# EAGLE design conc contro0l (EAGLE 9.6.2)
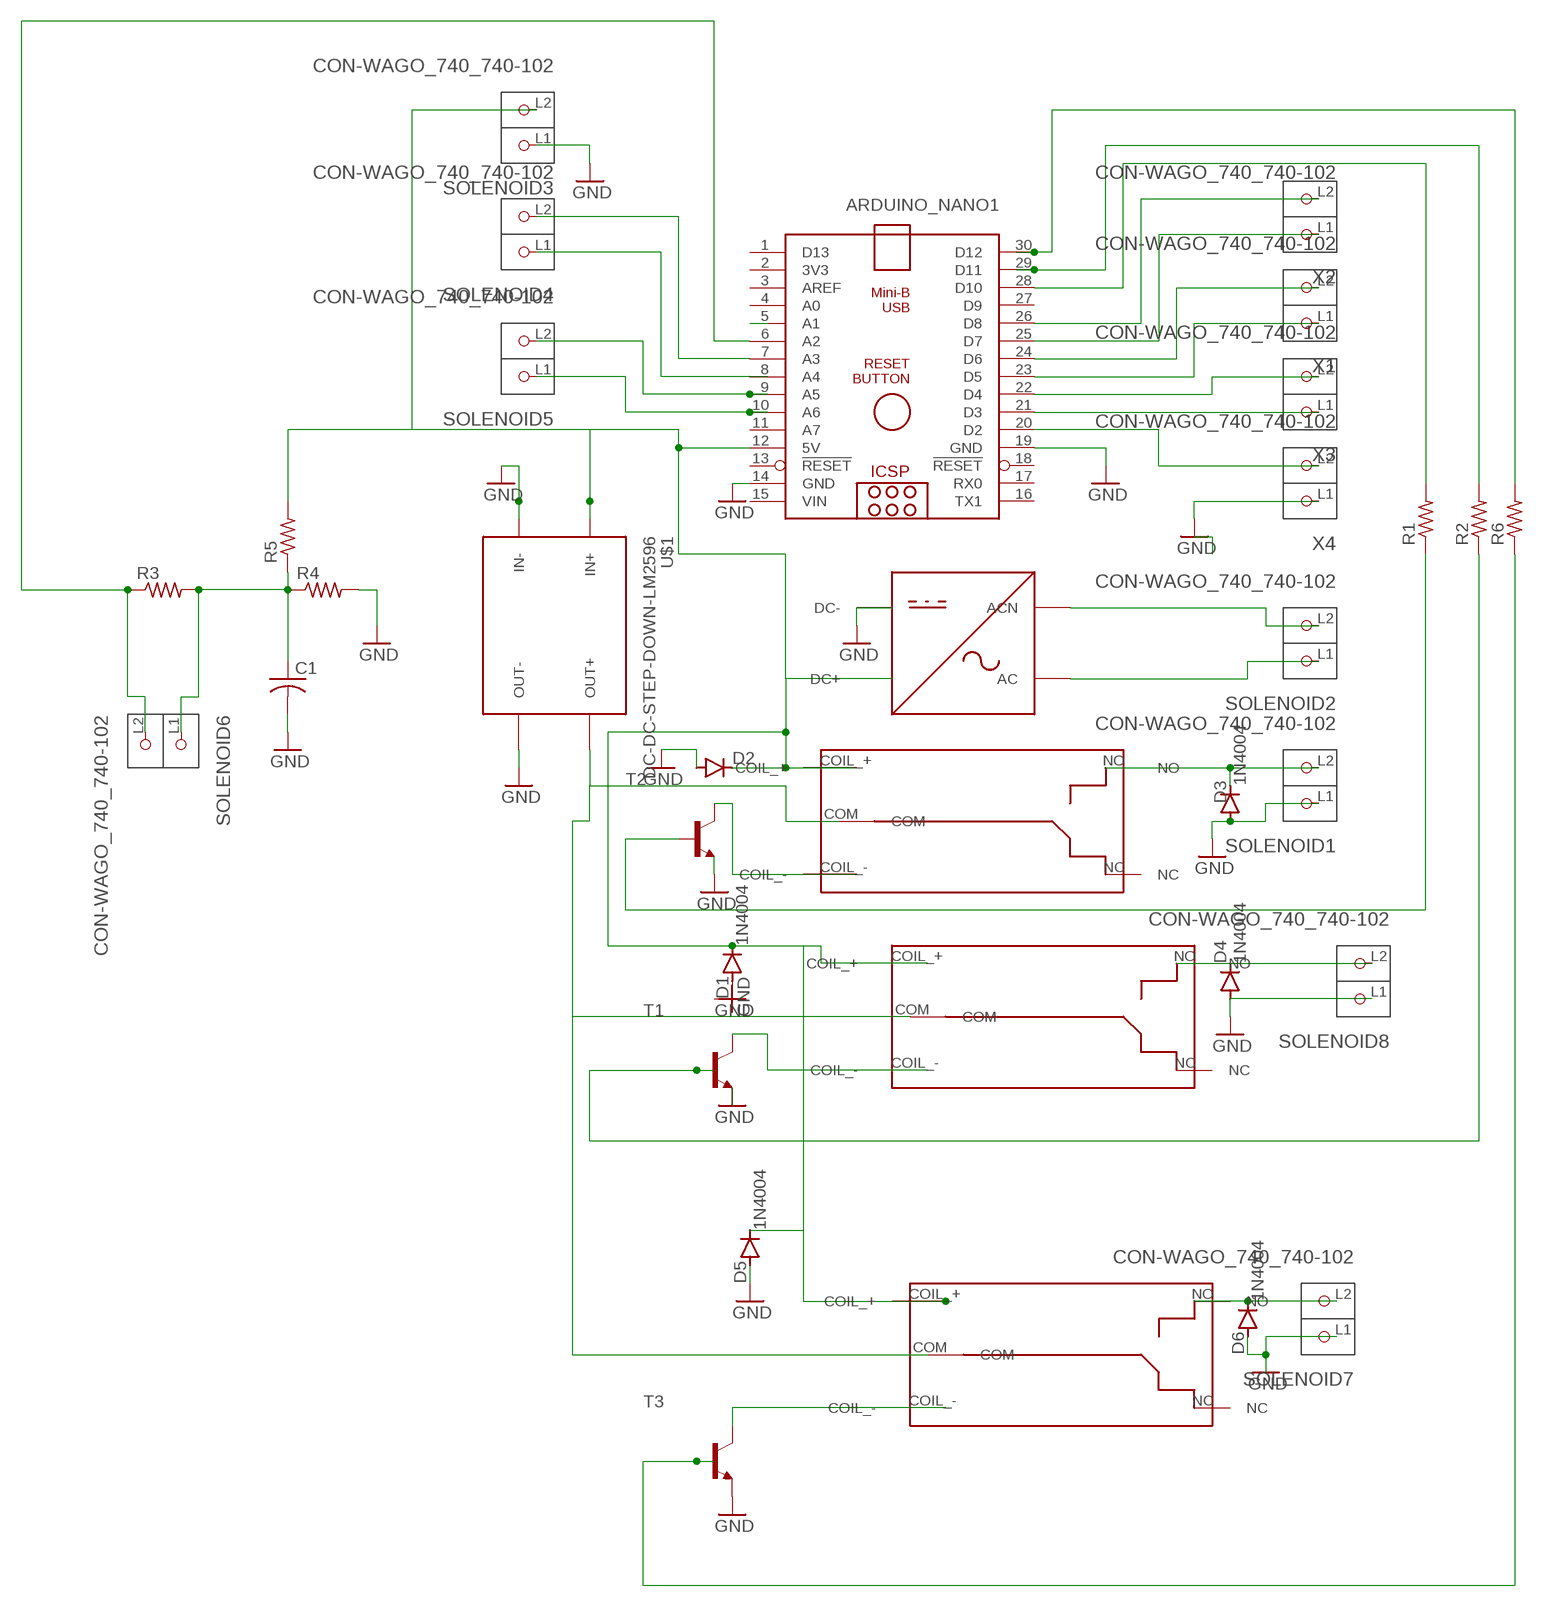
[diagram p0: schematic, sheet 1]

## Parts
ACDC  RPD10W1S  [2343]
ARDUINO_NANO1  ARDUINONANOV30-GHIT_ARDUINO_NANO  [ARDUINONANOV30-GHIT_ARDUINO_NANO]
C1  C-US025-024X044  [C025-024X044]
D1  1N4004  [DO41-10]
D2  1N4004  [DO41-10]
D3  1N4004  [DO41-10]
D4  1N4004  [DO41-10]
D5  1N4004  [DO41-10]
D6  1N4004  [DO41-10]
R1  R-US_0411/15  [0411/15]
R2  R-US_0411/15  [0411/15]
R3  R-US_0309/10  [0309/10]
R4  R-US_0309/10  [0309/10]
R5  R-US_0309/10  [0309/10]
R6  R-US_0411/15  [0411/15]
SOLENOID1  CON-WAGO_740_740-102  [CON-WAGO_740_P-740-102]
SOLENOID2  CON-WAGO_740_740-102  [CON-WAGO_740_P-740-102]
SOLENOID3  CON-WAGO_740_740-102  [CON-WAGO_740_P-740-102]
SOLENOID4  CON-WAGO_740_740-102  [CON-WAGO_740_P-740-102]
SOLENOID5  CON-WAGO_740_740-102  [CON-WAGO_740_P-740-102]
SOLENOID6  CON-WAGO_740_740-102  [CON-WAGO_740_P-740-102]
SOLENOID7  CON-WAGO_740_740-102  [CON-WAGO_740_P-740-102]
SOLENOID8  CON-WAGO_740_740-102  [CON-WAGO_740_P-740-102]
T1  2N2222-NPN-TO92-EBC  [TO92-EBC]
T2  2N2222-NPN-TO92-EBC  [TO92-EBC]
T3  2N2222-NPN-TO92-EBC  [TO92-EBC]
U$1  DC-DC-STEP-DOWN-LM2596  [DC-DC-STEP-DOWN-LM2596]
U$2  RELAY_JQC-3F(T73)A  [JQC-3F(T73)]
U$3  RELAY_JQC-3F(T73)A  [JQC-3F(T73)]
U$4  RELAY_JQC-3F(T73)A  [JQC-3F(T73)]
X1  CON-WAGO_740_740-102  [CON-WAGO_740_P-740-102]
X2  CON-WAGO_740_740-102  [CON-WAGO_740_P-740-102]
X3  CON-WAGO_740_740-102  [CON-WAGO_740_P-740-102]
X4  CON-WAGO_740_740-102  [CON-WAGO_740_P-740-102]

## Nets
GND [power]: ACDC.DC- ARDUINO_NANO1.14(GND) ARDUINO_NANO1.19(GND) C1.2 D1.A D2.A D3.A D4.A D5.A D6.A R4.2 SOLENOID1.L1(P1) SOLENOID3.L1(P1) SOLENOID7.L1(P1) SOLENOID8.L1(P1) T1.E T2.E T3.E U$1.IN- U$1.OUT- X4.L1(P1)
N$1 [power]: ARDUINO_NANO1.7(A3) SOLENOID4.L2(P2)
N$2 [power]: ARDUINO_NANO1.20(D2) X4.L2(P2)
N$3 [power]: ARDUINO_NANO1.21(D3) X3.L1(P1)
N$4 [power]: ARDUINO_NANO1.22(D4) X3.L2(P2)
N$5 [power]: ARDUINO_NANO1.23(D5) X1.L1(P1)
N$6 [power]: ARDUINO_NANO1.24(D6) X1.L2(P2)
N$7: ARDUINO_NANO1.28(D10) R1.2
N$8 [power]: ARDUINO_NANO1.26(D8) X2.L2(P2)
N$9 [power]: ARDUINO_NANO1.9(A5) SOLENOID5.L2(P2)
N$10 [power]: ACDC.DC+ ARDUINO_NANO1.12(5V) D1.C D2.C D5.C R5.2 SOLENOID3.L2(P2) U$1.IN+ U$2.COIL_+ U$3.COIL_+ U$4.COIL_+
N$11 [power]: ACDC.ACN SOLENOID2.L2(P2)
N$12 [power]: ARDUINO_NANO1.10(A6) SOLENOID5.L1(P1)
N$13 [power]: D3.C SOLENOID1.L2(P2) U$2.NO
N$14 [power]: D4.C SOLENOID8.L2(P2) U$3.NO
N$15 [power]: T2.C U$2.COIL_-
N$16 [power]: R2.1 T1.B
N$17 [power]: ARDUINO_NANO1.25(D7) X2.L1(P1)
N$18 [power]: ACDC.AC SOLENOID2.L1(P1)
N$19 [power]: C1.1 R3.2 R4.1 R5.1 SOLENOID6.L1(P1)
N$20 [power]: R1.1 T2.B
N$22 [power]: T1.C U$3.COIL_-
N$23 [power]: ARDUINO_NANO1.5(A1)
N$24 [power]: ARDUINO_NANO1.8(A4) SOLENOID4.L1(P1)
N$25: R6.1 T3.B
N$26 [power]: ARDUINO_NANO1.6(A2) R3.1 SOLENOID6.L2(P2)
N$27: U$1.OUT+ U$2.COM U$3.COM U$4.COM
N$28 [power]: ARDUINO_NANO1.29(D11) R2.2
N$29 [power]: ARDUINO_NANO1.30(D12) R6.2
N$30: T3.C U$4.COIL_-
N$31: D6.C SOLENOID7.L2(P2) U$4.NO
Unconnected: ARDUINO_NANO1.1(D13) ARDUINO_NANO1.2(3V3) ARDUINO_NANO1.3(AREF) ARDUINO_NANO1.4(A0) ARDUINO_NANO1.11(A7) ARDUINO_NANO1.13(!RESET) ARDUINO_NANO1.16(TX1) ARDUINO_NANO1.17(RX0) ARDUINO_NANO1.18(!RESET) ARDUINO_NANO1.27(D9) U$2.NC U$3.NC U$4.NC

## Power pins joined to a net without a drawn wire
VIN: ARDUINO_NANO1.15(VIN)

## Library data of the parts
ACDC = My_libray:RPD10W1S
ARDUINO_NANO1 = Arduino Nano GHII:ARDUINONANOV30-GHIT_ARDUINO_NANO: Arduino Nano V3.0 Overview: The Arduino Nano is a small, complete, and breadboard-friendly board based on the ATmega328 (Arduino Nano 3.x) or ATmega168 (Arduino Nano 2.x). It has more or less the same functionality of the Arduino Duemilanove, but in a different package. It lacks only a DC power jack, and works with a Mini-B USB cable instead of a standard one. The Nano was designed and is being produced by Gravitech. Specifications: Microcontroller Atmel ATmega168 or ATmega328 Operating Voltage (logic level) 5 V Input Voltage (recommended) 7-12 V Input Voltage (limits) 6-20 V Digital I/O Pins 14 (of which 6 provide PWM output) Analog Input Pins 8 DC Current per I/O Pin 40 mA Flash Memory 16 KB (ATmega168) or 32 KB (ATmega328) of which 2 KB used by bootloader SRAM 1 KB (ATmega168) or 2 KB (ATmega328) EEPROM 512 bytes (ATmega168) or 1 KB (ATmega328) Clock Speed 16 MHz Dimensions 0.73" x 1.70" Length 45 mm Width 18 mm Weigth 5 g Power: The Arduino Nano can be powered via the Mini-B USB connection, 6-20V unregulated external power supply (pin 30), or 5V regulated external power supply (pin 27). The power source is automatically selected to the highest voltage source. Memory: The ATmega168 has 16 KB of flash memory for storing code (of which 2 KB is used for the bootloader); the ATmega328 has 32 KB, (also with 2 KB used for the bootloader). The ATmega168 has 1 KB of SRAM and 512 bytes of EEPROM (which can be read and written with the EEPROM library); the ATmega328 has 2 KB of SRAM and 1 KB of EEPROM. Input and Output: Each of the 14 digital pins on the Nano can be used as an input or output, using pinMode(), digitalWrite(), and digitalRead() functions. They operate at 5 volts. Each pin can provide or receive a maximum of 40 mA and has an internal pull-up resistor (disconnected by default) of 20-50 kOhms. In addition, some pins have specialized functions. Visit Arduino - ArduinoBoardNano <https://www.arduino.cc/en/Main/ArduinoBoardNano>
C1 = adafruit:C-US: CAPACITOR, American symbol
D1-D6 = diode:1N4004: DIODE general purpose rectifier, 1 A
R1-R6 = adafruit:R-US_: RESISTOR, American symbol
SOLENOID1-SOLENOID8 X1-X4 = Termnal block:CON-WAGO_740_740-102: Serie 740, Klemmenleiste für Leiterplatten 1 Lötstift/Pol / Series 740, PCB terminal strip 1 solder pin/pole Polzahl / Pole No.: 2 Rastermaß / Pitch: 5 mm Bemessungsspannung / Rated Voltage: 320 V Nennstrom / Nominal Current: 16 A Leiterquerschnitt / Conductor Size: 0.08 - 2.5 mm² Anschlusstechnik / Connection Technology: CAGE CLAMP® Lötstiftlänge: / Solder Pin Length: 5.1 mm Leitereinführung (zur Platine) / Conductor entry angle (to PCB): 0 ° Farbe / Color: grau / gray Stand: 01.01.2012. Die jeweils aktuellen Daten zu diesem Artikel finden Sie in unserem Produktkatalog, den Sie unter www.wago.com einsehen können. As of: 01/01/2012. Please find the newest data for this article in our product catalogue, which can be viewed under www.wago.com.
T1-T3 = transistor-neu-to92:*-NPN-: NPN Transistror
U$1 = GHIdiy-modules:DC-DC-STEP-DOWN-LM2596: DC/DC Step-Down Regulator based on LM2596-ADJ chip LM2596 datasheet available here: http://www.ti.com/lit/ds/symlink/lm2596.pdf Click here to find device on ebay.com <http://www.ebay.com/sch/lm2596+power+regulator>
U$2-U$4 = GHII Relay JQC:RELAY_JQC-3F(T73)

## Net classes
1 power: width 1.27 mm, drill 0.864 mm, clearance 0.762 mm

## Board
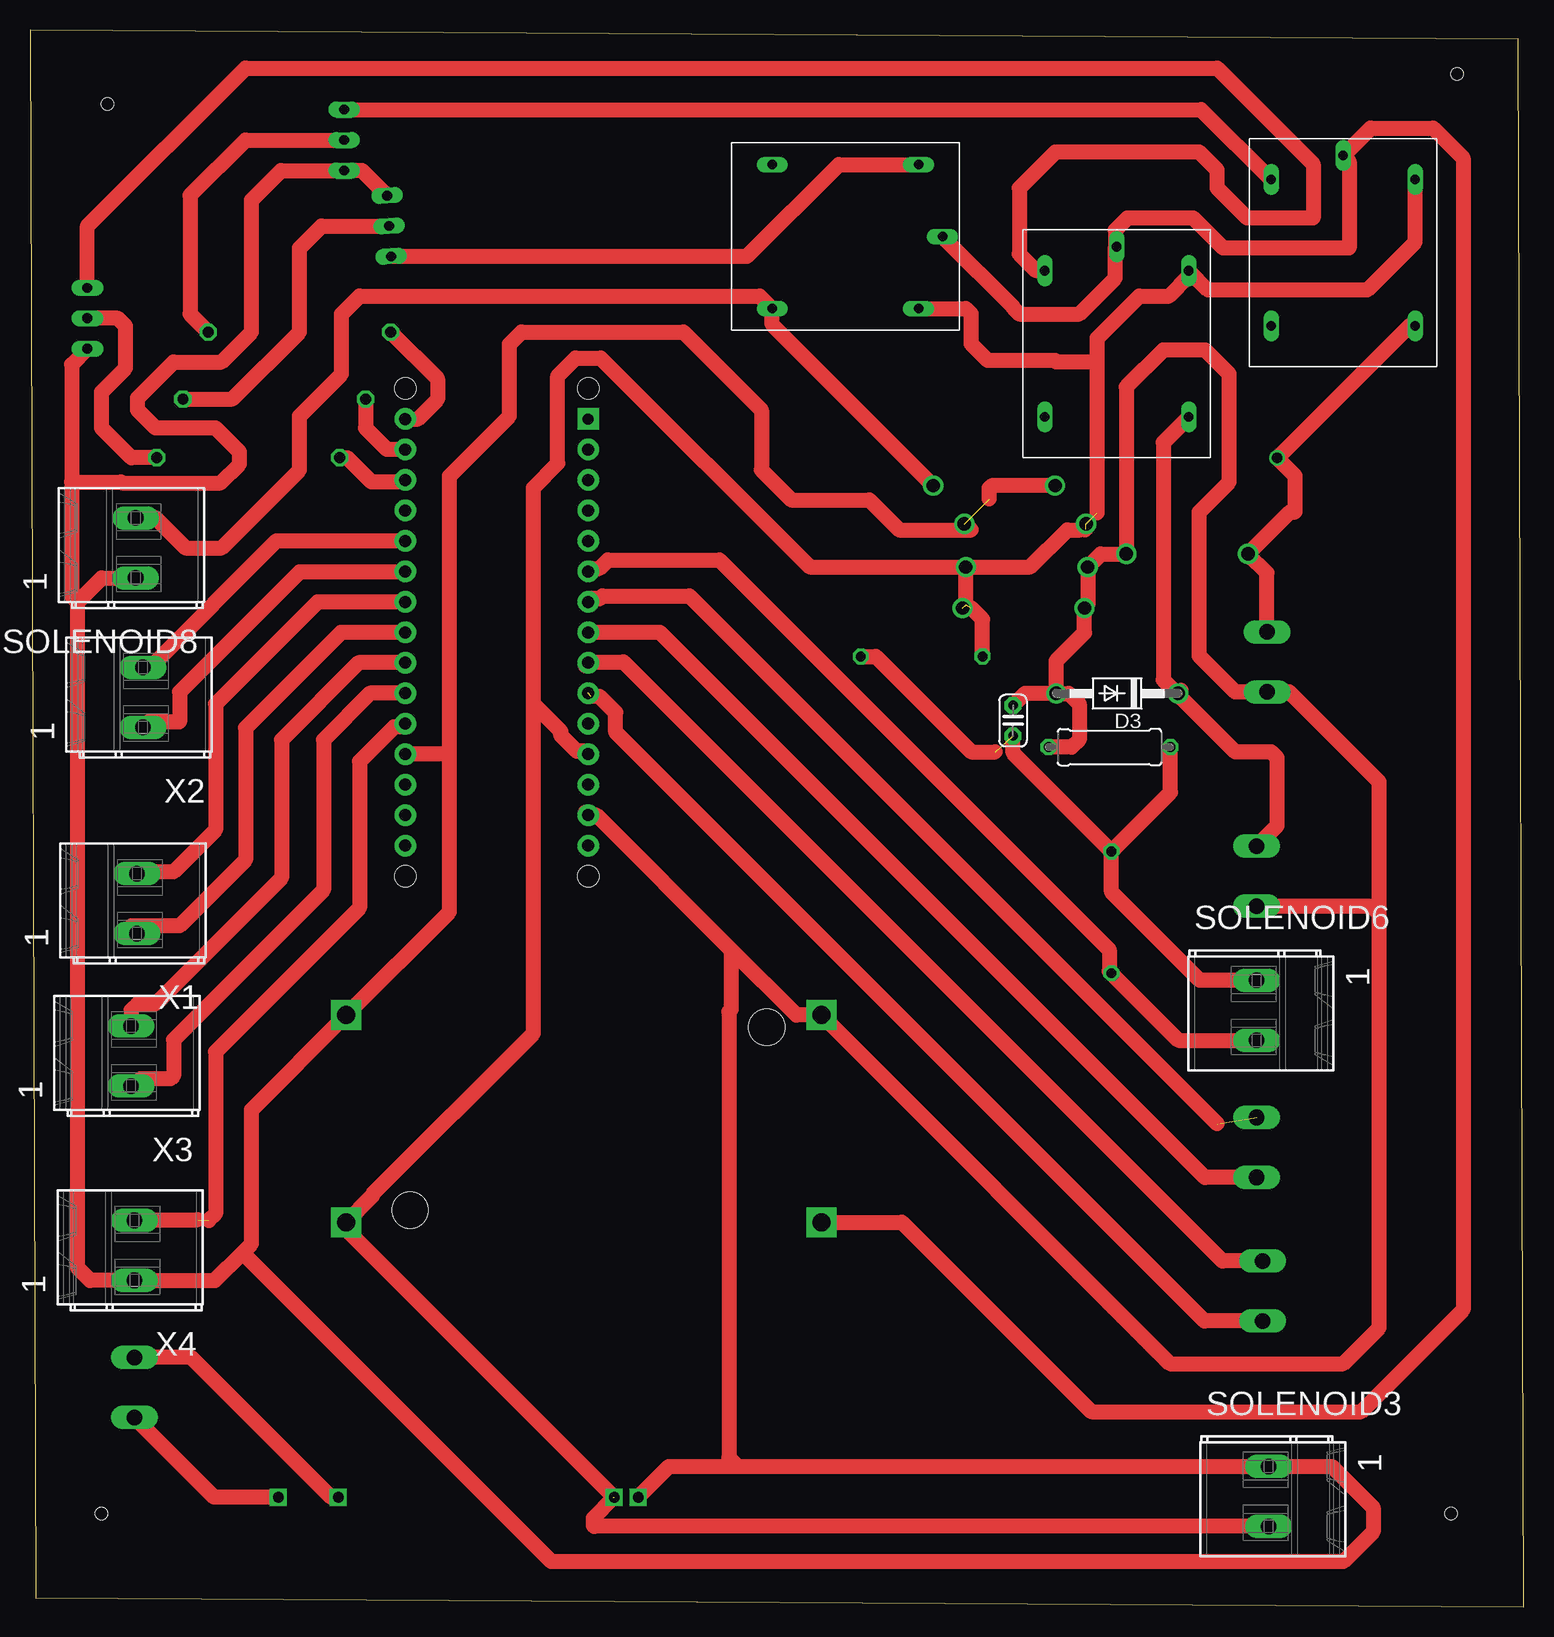
[diagram p1: board, top side]
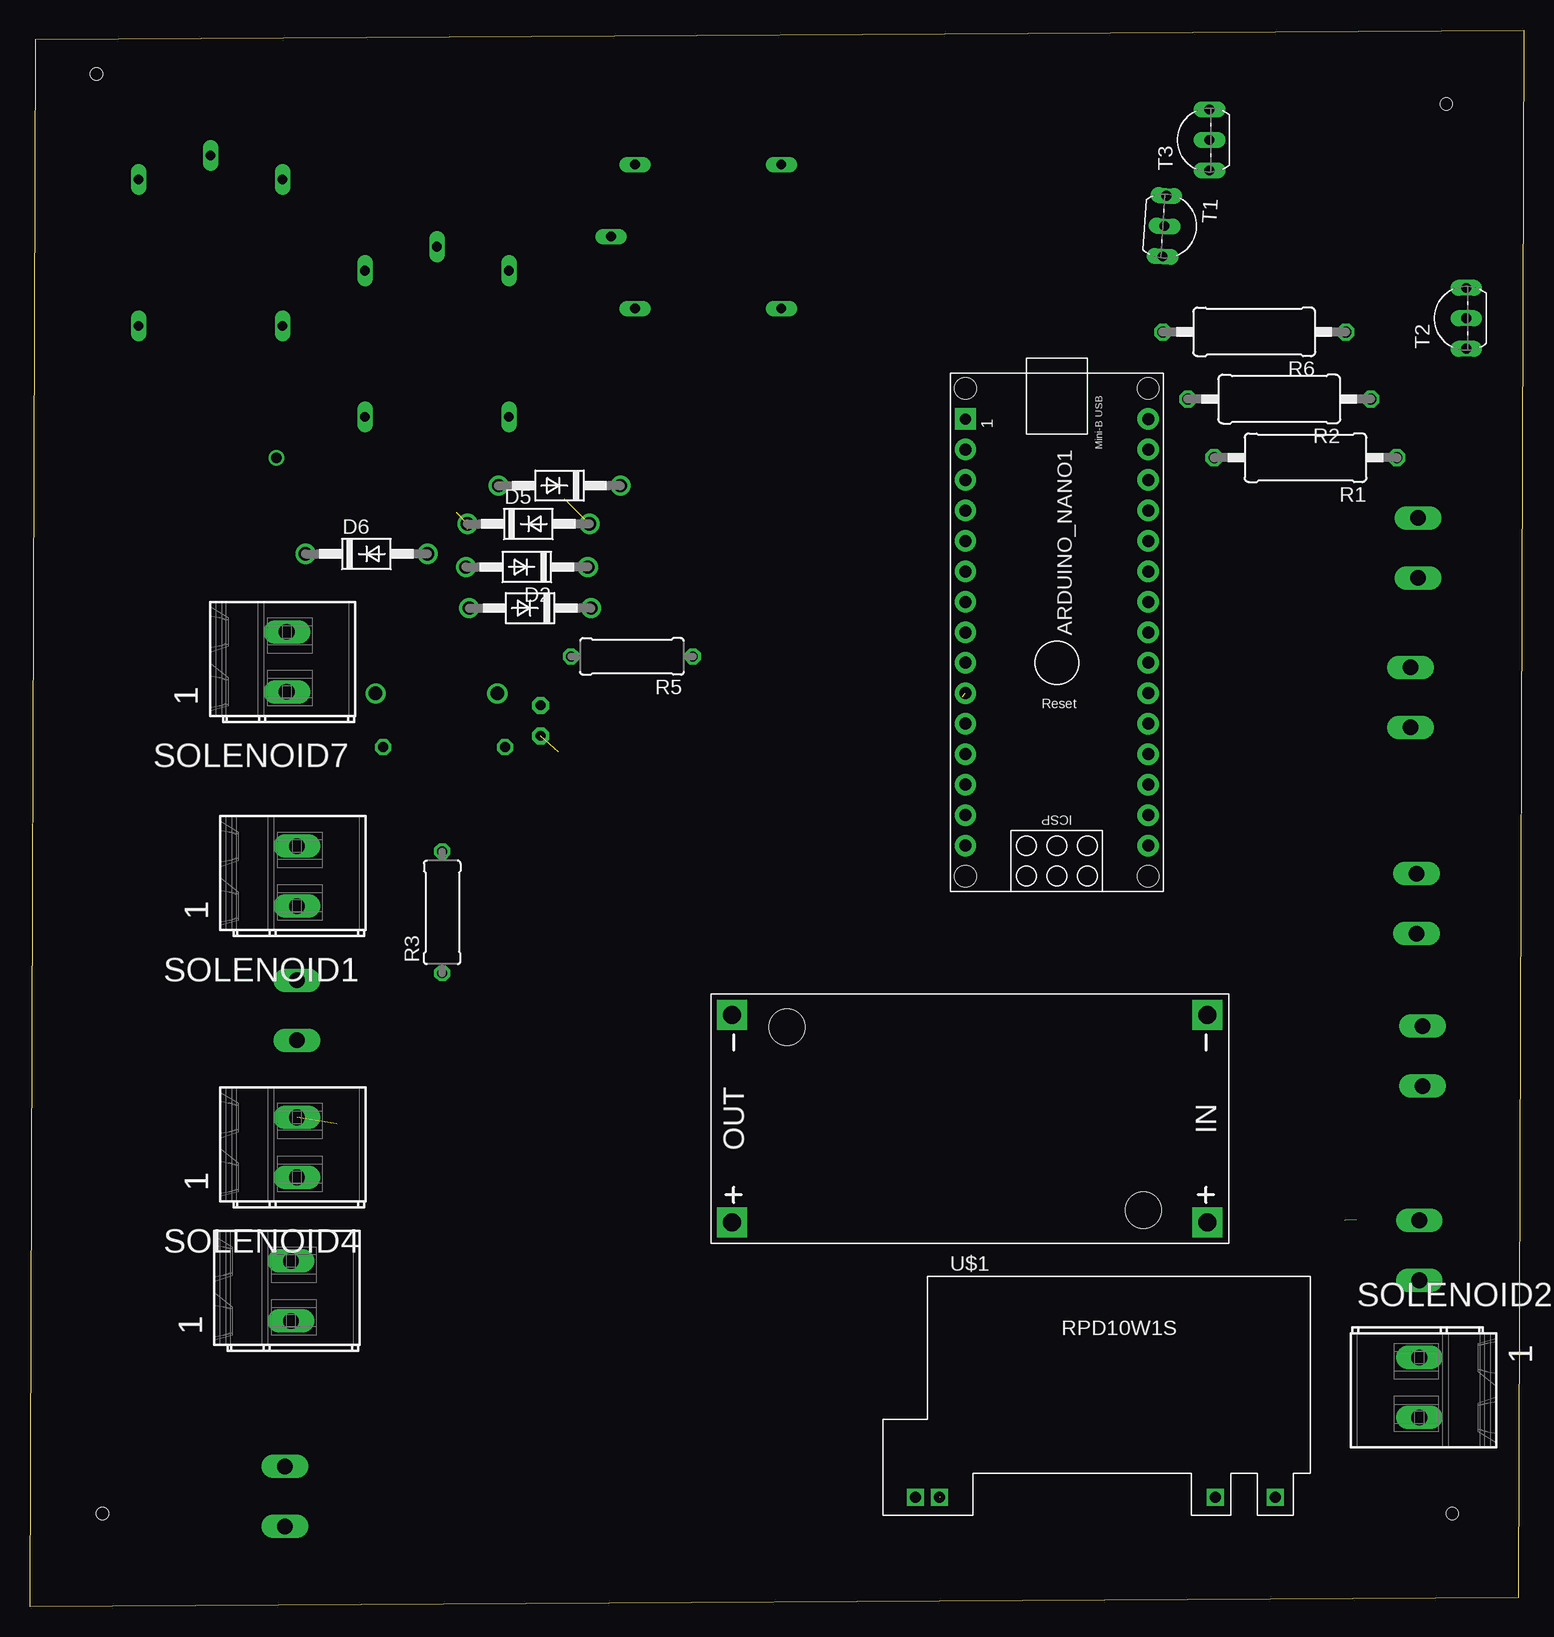
[diagram p2: board, bottom side, seen from below]

Size 124.51 x 131.44 mm. Coordinates in mm from the lower left corner, seen from the top.
Outline: 0.46,0.77 124.51,0 124.05,130.67 0,131.44 0.46,0.77
Copper layers (1*16): Top 0.035mm / dielectric 1.5mm / Bottom 0.035mm
Design rules "default *": minimum track width 6mil, minimum drill 0.35mm, track to track 30mil, track to pad 6mil, pad to pad 6mil, via to via 6mil, smd to smd 6mil, copper to edge 40mil, drill to drill 6mil, minimum pad ring 10mil, minimum via ring 8mil, stop-mask expansion 4mil, vias tented up to drill 0mil, thermal gap 10mil
Holes 1 mm at 118.96,127.77 118.46,7.77 5.96,7.77 6.46,125.27

### Footprints (pad centres in the part's own frame; a part is rotated, then mirrored left to right if it is on the bottom)
2343 = drill 0.9 square: AC 2.7,-13.5; ACN 7.7,-13.5; DC+ -20.3,-13.5; DC- -22.3,-13.5
ARDUINONANOV30-GHIT_ARDUINO_NANO = drill 0.9 pad 1.778 square: 1 -20.32,-7.62 | drill 1 pad 1.778: 2 -17.78,-7.62; 3 -15.24,-7.62; 4 -12.7,-7.62; 5 -10.16,-7.62; 6 -7.62,-7.62; 7 -5.08,-7.62; 8 -2.54,-7.62; 9 0,-7.62; 10 2.54,-7.62; 11 5.08,-7.62; 12 7.62,-7.62; 13 10.16,-7.62; 14 12.7,-7.62; 15 15.24,-7.62; 16 15.24,7.62; 17 12.7,7.62; 18 10.16,7.62; 19 7.62,7.62; 20 5.08,7.62; 21 2.54,7.62; 22 0,7.62; 23 -2.54,7.62; 24 -5.08,7.62; 25 -7.62,7.62; 26 -10.16,7.62; 27 -12.7,7.62; 28 -15.24,7.62; 29 -17.78,7.62; 30 -20.32,7.62 | hole 1.778: -22.86,-7.62; -22.86,7.62; 17.78,7.62; 17.78,-7.62
C025-024X044 = drill 0.813 pad 1.422 octagon: 1 -1.27,0; 2 1.27,0
DO41-10 = drill 1.118: A 5.08,0; C -5.08,0
0411/15 = drill 0.914 octagon: 1 -7.62,0; 2 7.62,0
0309/10 = drill 0.813 octagon: 1 -5.08,0; 2 5.08,0
CON-WAGO_740_P-740-102 = drill 1.3 long: L1 -0.35,2.5; L2 -0.35,-2.5
TO92-EBC = drill 0.813 long: B 0,-1.27; C 2.54,-1.27; E -2.54,-1.27
DC-DC-STEP-DOWN-LM2596 = drill 1.5 pad 2.5 square: IN+ -19.812,8.636; IN- -19.812,-8.636; OUT+ 19.812,8.636; OUT- 19.812,-8.636 | hole 3: -14.478,7.62; 15.24,-7.62
JQC-3F(T73) = drill 0.8 long: COIL_+ -7.2,6; COIL_- -7.2,-6; COM -9.2,0; NC 5,-6; NO 5,6

### Placement (x,y rotation side)
ACDC  28.4,22.63 0 bottom
ARDUINO_NANO1  38.91,78.69 270 bottom
C1  81.95,73.87 90 top
D1  82.82,83.25 180 bottom
D2  83.09,86.67 180 bottom
D3  90.63,76.14 180 top
D4  80.37,93.46 180 bottom
D5  82.96,90.27 0 bottom
D6  96.46,87.77 0 bottom
R1  18.18,95.78 180 bottom
R2  20.37,100.67 180 bottom
R3  90.15,57.89 90 bottom
R4  89.99,71.66 180 top
R5  74.33,79.22 180 bottom
R6  22.46,106.27 180 bottom
SOLENOID1  102.6,60.9 180 bottom
SOLENOID2  8.35,18.28 0 bottom
SOLENOID3  103.6,9.2 0 top
SOLENOID4  102.6,38.29 180 bottom
SOLENOID5  103.1,26.32 180 bottom
SOLENOID6  102.6,49.72 0 top
SOLENOID7  103.46,78.77 180 bottom
SOLENOID8  8.46,88.27 180 top
T1  28.67,115.02 266.3 bottom
T2  6.05,107.41 90 bottom
T3  27.46,122.27 90 bottom
U$1  46.17,40.69 180 bottom
U$2  90.59,104.18 270 top
U$3  66.87,114.23 180 top
U$4  109.46,111.77 270 top
X1  8.58,58.61 180 top
X2  9.08,75.81 180 top
X3  8.08,45.91 180 top
X4  8.35,29.71 180 top

### Tracks (layer width: path | path; a pad name or v marks a point on that pad's centre or on a via)
GND  (1 unrouted)
  Top 1.27: 17.71,29.52 15.4,27.21 X4.L1 5.02,27.21 3.96,28.27 3.96,83.77 | 17.71,29.52 18.46,30.27 18.46,41.43 U$1.IN- 34.96,57.93 34.96,71.07 | 58.45,54.76 63.89,49.33 U$1.OUT- 95.04,20.27 109.46,20.27 112.46,23.27 112.46,57.77 | 58.45,54.76 47.22,65.99 ARDUINO_NANO1.14 46.28,66.24 | 34.96,71.07 ARDUINO_NANO1.19 | 50.84,9.27 ACDC.DC- 53.27,11.7 58.96,11.7 | 3.96,83.77 5.96,85.77 SOLENOID8.L1 | 3.96,83.77 3.46,84.27 3.46,93.77 | 112.46,57.77 112.46,68.77 104.96,76.27 SOLENOID7.L1 100.46,76.27 97.46,79.27 97.46,91.27 99.96,93.77 99.96,102.77 97.96,104.77 94.46,104.77 91.38,101.69 D6.A 89.27,87.77 D2.A 88.17,83.52 D1.A 87.9,81.21 85.55,78.86 D3.A | SOLENOID1.L1 111.83,58.4 112.46,57.77 | D3.A 86.59,76.14 87.46,75.27 87.46,72.27 86.85,71.66 R4.2 | D3.A 82.95,76.14 C1.2 | 34.96,71.07 34.96,94.27 39.96,99.27 39.96,105.27 40.96,106.27 54.46,106.27 60.96,99.77 60.96,94.77 63.46,92.27 69.96,92.27 72.46,89.77 78.46,89.77 77.96,90.27 D5.A | 79.96,92.35 79.96,93.27 80.15,93.46 D4.A | T3.E 26.28,119.64 | T2.E 3.46,103.55 3.46,93.77 | 3.46,93.77 7.59,93.77 7.68,93.67 15.86,93.67 17.46,95.27 17.46,96.27 15.46,98.27 10.46,98.27 8.96,99.77 8.96,100.77 11.96,103.77 15.96,103.77 18.46,106.27 18.46,117.27 20.92,119.73 T3.E | 58.96,11.7 SOLENOID3.L1 108.53,11.7 111.96,8.27 111.96,6.27 109.46,3.77 43.46,3.77 17.71,29.52 | 58.45,54.76 58.45,49.81 58.26,49.62 58.26,12.4 58.96,11.7 | T1.E 27.68,119.73 T3.E
N$1  (1 unrouted)
  Top 1.27: ARDUINO_NANO1.7 46.78,84.02 47.48,84.02 47.72,84.27 54.96,84.27 98.96,40.27
N$2  (1 unrouted)
  Top 1.27: ARDUINO_NANO1.20 31.04,73.36 30.34,73.36 27.46,70.47 27.46,58.27 15.46,46.27 15.46,32.77 14.9,32.21 | X4.L2 8.76,32.27 13.96,32.27
N$3
  Top 1.27: ARDUINO_NANO1.21 28.34,76.15 24.46,72.27 24.46,59.77 11.96,47.27 11.96,44.27 11.71,44.02 9.21,44.02 8.6,43.41 X3.L1
N$4
  Top 1.27: ARDUINO_NANO1.22 27.38,78.69 20.96,72.27 20.96,60.77 10.46,50.27 8.96,50.27 8.43,49.74 X3.L2
N$5
  Top 1.27: ARDUINO_NANO1.23 25.92,81.23 17.96,73.27 17.96,62.27 12.46,56.77 8.46,56.77 8.46,56.58 X1.L1
N$6
  Top 1.27: ARDUINO_NANO1.24 23.96,83.77 15.46,75.27 15.46,64.77 11.96,61.27 9.09,61.27 X1.L2
N$7
  Top 1.27: ARDUINO_NANO1.28 31.13,93.77 28.46,93.77 26.45,95.78 R1.2
N$8
  Top 1.27: ARDUINO_NANO1.26 20.54,88.85 10,78.31 X2.L2
N$9
  Top 1.27: SOLENOID5.L2 99.41,28.82 49.46,78.77 46.61,78.77 ARDUINO_NANO1.9 46.28,78.44
N$10  (5 unrouted)
  Top 1.27: 48.46,8.89 ACDC.DC+ 26.36,31.47 U$1.IN+ 28.54,34.24 28.54,34.38 41.96,47.79 41.96,75.27 | ARDUINO_NANO1.12 46.28,71.32 45.58,71.32 44.24,72.66 44.24,72.99 41.96,75.27 | 41.96,75.27 41.96,93.27 43.99,95.3 43.99,102.6 45.48,104.09 47.58,104.09 65,86.67 D2.C | 78.44,83.25 78.46,83.27 79.41,82.32 R5.2 | 78.01,83.52 D2.C | 87.96,89.77 88.04,89.85 | 88.96,91.19 88.96,103.77 | 88.96,103.77 85.55,103.77 85.44,103.88 79.84,103.88 78.46,105.27 78.46,107.77 78,108.23 U$3.COIL_+ | SOLENOID3.L2 47.03,6.7 46.96,6.77 46.96,7.39 48.6,9.03 48.6,9.13 | U$4.COIL_+ 115.46,113.77 111.46,109.77 98.2,109.77 U$2.COIL_+ 96.59,110.9 94.96,109.27 92.46,109.27 88.96,105.77 88.96,103.77 | D2.C 83.36,86.67 86.46,89.77 87.54,89.77 D5.C
N$11
  Top 1.27: ACDC.ACN 15.35,9.13 SOLENOID2.L2
N$12  (1 unrouted)
  Top 1.27: SOLENOID5.L1 97.91,23.82 48.82,72.91 48.82,74.56 47.48,75.9 46.78,75.9
N$13
  Top 1.27: SOLENOID1.L2 103.96,65.11 103.96,70.77 103.46,71.27 100.46,71.27 95.96,75.77 | D3.C 95.96,76.39 95.96,75.77 | U$2.NO 94.46,97.05 94.46,77.27 95.96,75.77
N$14
  Top 1.27: SOLENOID8.L2 10.46,90.77 12.96,88.27 15.96,88.27 22.46,94.77 22.46,99.27 25.96,102.77 25.96,107.77 27.46,109.27 60.83,109.27 U$3.NO 61.87,106.88 D4.C
N$15
  Top 1.27: T2.C 4.78,115.09 17.96,128.27 98.96,128.27 106.96,120.27 106.96,115.77 101.46,115.77 98.96,118.27 98.96,119.77 97.46,121.27 85.46,121.27 82.46,118.27 82.46,112.77 83.85,111.38 U$2.COIL_-
N$16
  Top 1.27: R2.1 16.86,100.67 22.46,106.27 22.46,113.27 24.29,115.1 T1.B
N$17
  Top 1.27: ARDUINO_NANO1.25 31.25,86.27 22.46,86.27 12.46,76.27 12.46,73.77 9.89,73.77 X2.L1
N$18
  Top 1.27: ACDC.AC 25.1,9.13 13.45,20.78 SOLENOID2.L1
N$19  (1 unrouted)
  Top 1.27: SOLENOID6.L1 97.51,52.22 90.15,59.58 R3.2 | R3.2 95.07,67.89 R4.1 | R3.2 81.95,71.17 C1.1 | R5.1 70.51,79.22 78.46,71.27 80.46,71.27
N$20
  Top 1.27: R1.1 8.45,95.78 5.96,98.27 5.96,101.27 7.96,103.27 7.96,106.77 7.32,107.41 T2.B
N$22
  Top 1.27: U$3.COIL_- 67.42,120.23 59.76,112.57 T1.C
N$24
  Top 1.27: SOLENOID4.L1 97.94,35.79 52.5,81.23 ARDUINO_NANO1.8
N$25
  Top 1.27: R6.1 13.34,107.77 13.34,117.65 17.96,122.27 T3.B
N$26
  Top 1.27: ARDUINO_NANO1.6 46.78,86.56 47.48,86.56 48.18,87.27 57.46,87.27 89.96,54.77 89.96,53 R3.1 95.74,47.22 SOLENOID6.L2
N$27
  Top 1.27: U$1.OUT+ 72.68,32.05 88.46,16.27 110.96,16.27 119.46,24.77 119.46,120.77 116.96,123.27 111.76,123.27 U$4.COM 109.96,120.47 109.96,113.27 99.46,113.27 96.96,115.77 91.46,115.77 90.46,114.77 90.46,113.25 | 90.46,113.25 U$2.COM | U$3.COM 81.96,108.34 81.96,108.27 82.46,107.77 87.46,107.77 90.46,110.77 90.46,113.25
N$28
  Top 1.27: ARDUINO_NANO1.29 29.76,96.47 27.96,98.27 27.99,98.27 R2.2
N$29
  Top 1.27: ARDUINO_NANO1.30 32.34,99.01 33.96,100.63 33.96,102.39 R6.2
N$30
  Top 1.27: T3.C 97.62,124.81 U$4.COIL_-
N$31  (via drill 0.86)
  Top 1.27: SOLENOID7.L2 103.11,86.2 D6.C 105.04,91.27 105.46,91.27 105.46,94.27 v103.96,95.77 114.96,106.77 U$4.NO